# EAGLE schematic eeZeeRGB (EAGLE 6.4)
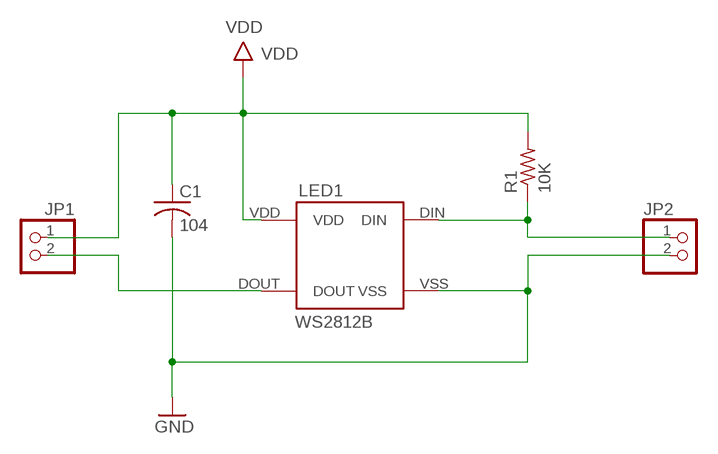
[diagram p0: schematic, sheet 1]

## Parts
C1  104  C-USC0603  [C0603]
JP1  PINHD-1X02_2.54-S  [1X02-S]
JP2  PINHD-1X02_2.54-S  [1X02-S]
LED1  WS2812B  [WS2812B]
R1  10K  R-US_R0603  [R0603]

## Nets
DIN: JP2.1 LED1.DIN R1.1
DOUT: JP1.2 LED1.DOUT
GND: C1.2 JP2.2 LED1.VSS
VDD: C1.1 JP1.1 LED1.VDD R1.2

## Library data of the parts
C1 = rcl:C-US: CAPACITOR, American symbol
JP1 JP2 = pinhead-2:PINHD-1X02: PIN HEADER
LED1 = bt_opto:WS2812B: WS2812B Intelligent Control LED WS2812B is a intelligent control LED light source that the control circuit and RGB chip are integrated in a package of 5050 components. It internal include intelligent digital port data latch and signal reshaping amplification drive circuit. Also include a precision internal oscillator and a 12V voltage programmable constant current control part, effectively ensuring the pixel point light color height consistent. Datasheet.pdf <http://www.mikrocontroller.net/attachment/180459/WS2812B_preliminary.pdf>
R1 = rcl:R-US_: RESISTOR, American symbol